# EAGLE design ライン_後 (EAGLE 9.6.2)
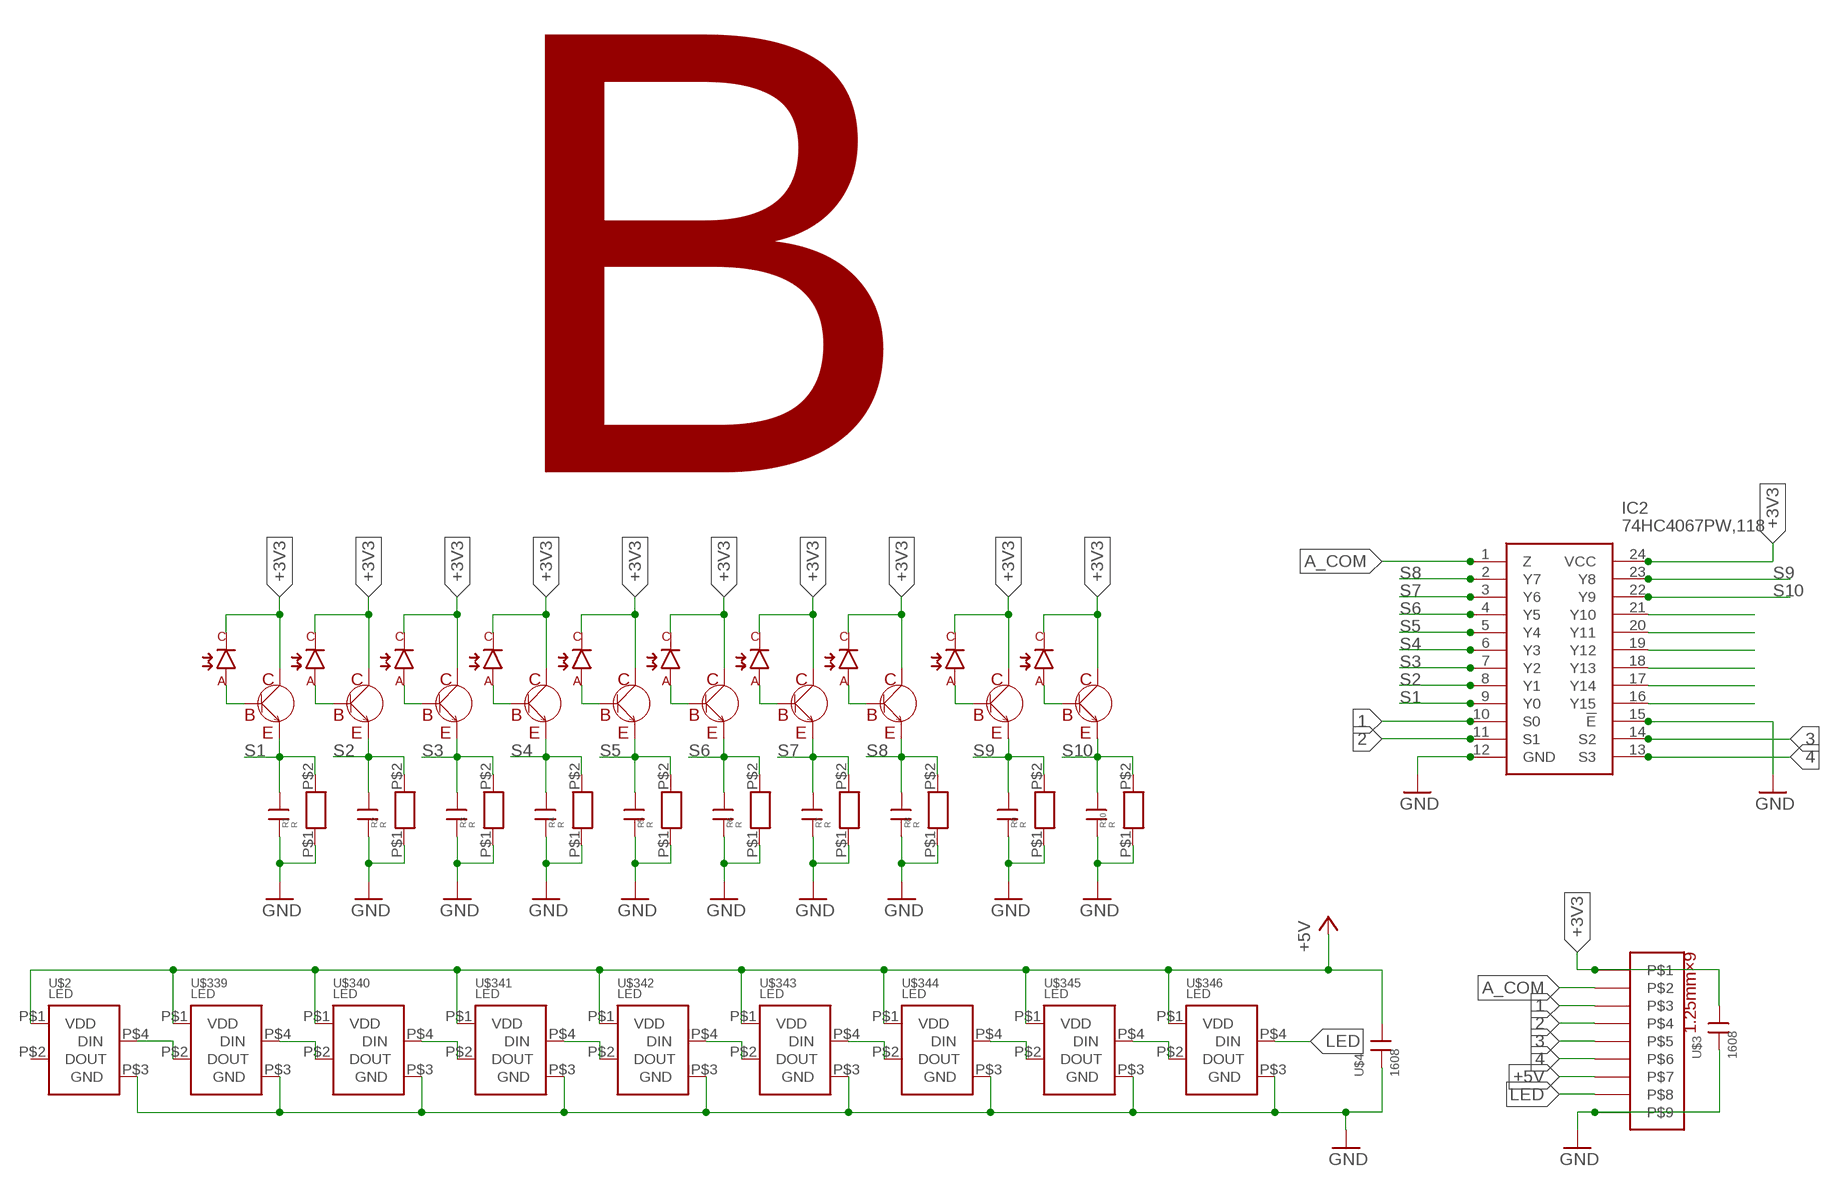
[diagram p0: schematic, sheet 1]

## Parts
C1  1608  [CON]
C2  1608  [CON]
C3  1608  [CON]
C4  1608  [CON]
C5  1608  [CON]
C6  1608  [CON]
C7  1608  [CON]
C8  1608  [CON]
C9  1608  [CON]
C10  1608  [CON]
IC2  74HC4067PW,118  [SOP65P640X110-24N]
R1  R  [1608]
R2  R  [1608]
R3  R  [1608]
R4  R  [1608]
R5  R  [1608]
R6  R  [1608]
R7  R  [1608]
R8  R  [1608]
R9  R  [1608]
R10  R  [1608]
U$1  1MMCON  [1MMCON]
U$2  LED  [LED]
U$3  1608  [CON]
U$4  1608  [CON]
U$33  2CS2712  [TRANS_SSM3J325F,LF]
U$34  フォトダイオード  [フォトダイオード]
U$35  2CS2712  [TRANS_SSM3J325F,LF]
U$36  フォトダイオード  [フォトダイオード]
U$37  2CS2712  [TRANS_SSM3J325F,LF]
U$38  フォトダイオード  [フォトダイオード]
U$39  2CS2712  [TRANS_SSM3J325F,LF]
U$40  フォトダイオード  [フォトダイオード]
U$41  2CS2712  [TRANS_SSM3J325F,LF]
U$42  フォトダイオード  [フォトダイオード]
U$43  2CS2712  [TRANS_SSM3J325F,LF]
U$44  フォトダイオード  [フォトダイオード]
U$45  2CS2712  [TRANS_SSM3J325F,LF]
U$46  フォトダイオード  [フォトダイオード]
U$47  2CS2712  [TRANS_SSM3J325F,LF]
U$48  フォトダイオード  [フォトダイオード]
U$49  2CS2712  [TRANS_SSM3J325F,LF]
U$50  フォトダイオード  [フォトダイオード]
U$51  2CS2712  [TRANS_SSM3J325F,LF]
U$52  フォトダイオード  [フォトダイオード]
U$339  LED  [LED]
U$340  LED  [LED]
U$341  LED  [LED]
U$342  LED  [LED]
U$343  LED  [LED]
U$344  LED  [LED]
U$345  LED  [LED]
U$346  LED  [LED]

## Nets
1: IC2.10(S0) U$1.P$3
2: IC2.11(S1) U$1.P$4
3: IC2.14(S2) U$1.P$5
4: IC2.13(S3) U$1.P$6
+3V3 [New Class]: IC2.24(VCC) U$1.P$1 U$3.P$1 U$33.C U$34.C U$35.C U$36.C U$37.C U$38.C U$39.C U$40.C U$41.C U$42.C U$43.C U$44.C U$45.C U$46.C U$47.C U$48.C U$49.C U$50.C U$51.C U$52.C
+5V [New Class]: U$1.P$7 U$2.P$1(VDD) U$4.P$1 U$339.P$1(VDD) U$340.P$1(VDD) U$341.P$1(VDD) U$342.P$1(VDD) U$343.P$1(VDD) U$344.P$1(VDD) U$345.P$1(VDD) U$346.P$1(VDD)
A_COM: IC2.1(Z) U$1.P$2
GND [New Class]: C1.P$2 C2.P$2 C3.P$2 C4.P$2 C5.P$2 C6.P$2 C7.P$2 C8.P$2 C9.P$2 C10.P$2 IC2.12(GND) IC2.15(!E) R1.P$1 R2.P$1 R3.P$1 R4.P$1 R5.P$1 R6.P$1 R7.P$1 R8.P$1 R9.P$1 R10.P$1 U$1.P$9 U$2.P$3(GND) U$3.P$2 U$4.P$2 U$339.P$3(GND) U$340.P$3(GND) U$341.P$3(GND) U$342.P$3(GND) U$343.P$3(GND) U$344.P$3(GND) U$345.P$3(GND) U$346.P$3(GND)
LED: U$1.P$8 U$346.P$4(DIN)
N$2: U$2.P$4(DIN) U$339.P$2(DOUT)
N$3: IC2.21(Y10)
N$4: IC2.20(Y11)
N$5: IC2.19(Y12)
N$6: IC2.18(Y13)
N$7: IC2.17(Y14)
N$8: IC2.16(Y15)
N$23: U$33.B U$34.A
N$24: U$35.B U$36.A
N$25: U$37.B U$38.A
N$26: U$39.B U$40.A
N$27: U$41.B U$42.A
N$28: U$43.B U$44.A
N$29: U$45.B U$46.A
N$30: U$47.B U$48.A
N$31: U$49.B U$50.A
N$32: U$51.B U$52.A
N$139: U$339.P$4(DIN) U$340.P$2(DOUT)
N$140: U$340.P$4(DIN) U$341.P$2(DOUT)
N$141: U$343.P$4(DIN) U$344.P$2(DOUT)
N$142: U$344.P$4(DIN) U$345.P$2(DOUT)
N$143: U$345.P$4(DIN) U$346.P$2(DOUT)
N$144: U$341.P$4(DIN) U$342.P$2(DOUT)
N$145: U$342.P$4(DIN) U$343.P$2(DOUT)
S1: C1.P$1 IC2.9(Y0) R1.P$2 U$33.E
S2: C2.P$1 IC2.8(Y1) R2.P$2 U$35.E
S3: C3.P$1 IC2.7(Y2) R3.P$2 U$37.E
S4: C4.P$1 IC2.6(Y3) R4.P$2 U$39.E
S5: C5.P$1 IC2.5(Y4) R5.P$2 U$41.E
S6: C6.P$1 IC2.4(Y5) R6.P$2 U$43.E
S7: C7.P$1 IC2.3(Y6) R7.P$2 U$45.E
S8: C8.P$1 IC2.2(Y7) R8.P$2 U$47.E
S9: C9.P$1 IC2.23(Y8) R9.P$2 U$49.E
S10: C10.P$1 IC2.22(Y9) R10.P$2 U$51.E
Unconnected: U$2.P$2(DOUT)

## Notes on the sheet
- B

## Library data of the parts
C1-C10 U$3 U$4 = con1608:1608
IC2 = 16ch MUX:74HC4067PW,118: 74HC(T)4067 - 16-channel analog multiplexer/demultiplexer@en-us Source: Datasheet <https://assets.nexperia.com/documents/data-sheet/74HC_HCT4067.pdf>; DESCRIPTION: 74HC(T)4067 - 16-channel analog multiplexer/demultiplexer@en-us; HEIGHT: 1.1mm; MANUFACTURER_NAME: Nexperia; MANUFACTURER_PART_NUMBER: 74HC4067PW,118; MOUSER_PART_NUMBER: 771-74HC4067PW-T; MOUSER_PRICE-STOCK: https://www.mouser.co.uk/ProductDetail/Nexperia/74HC4067PW118?qs=P62ublwmbi9BArRi%252BuDUjA%3D%3D
R1-R10 = R 1608:R
U$1 = 9P_1.25mmCON:1MMCON
U$2 U$339-U$346 = フルカラーLED:LED
U$33 U$35 U$37 U$39 U$41 U$43 U$45 U$47 U$49 U$51 = 2CS2712:2CS2712
U$34 U$36 U$38 U$40 U$42 U$44 U$46 U$48 U$50 U$52 = フォトダイオード:フォトダイオード

## Net classes
1 New Class: width 0.229 mm
2 NS: width 0.254 mm

## Board
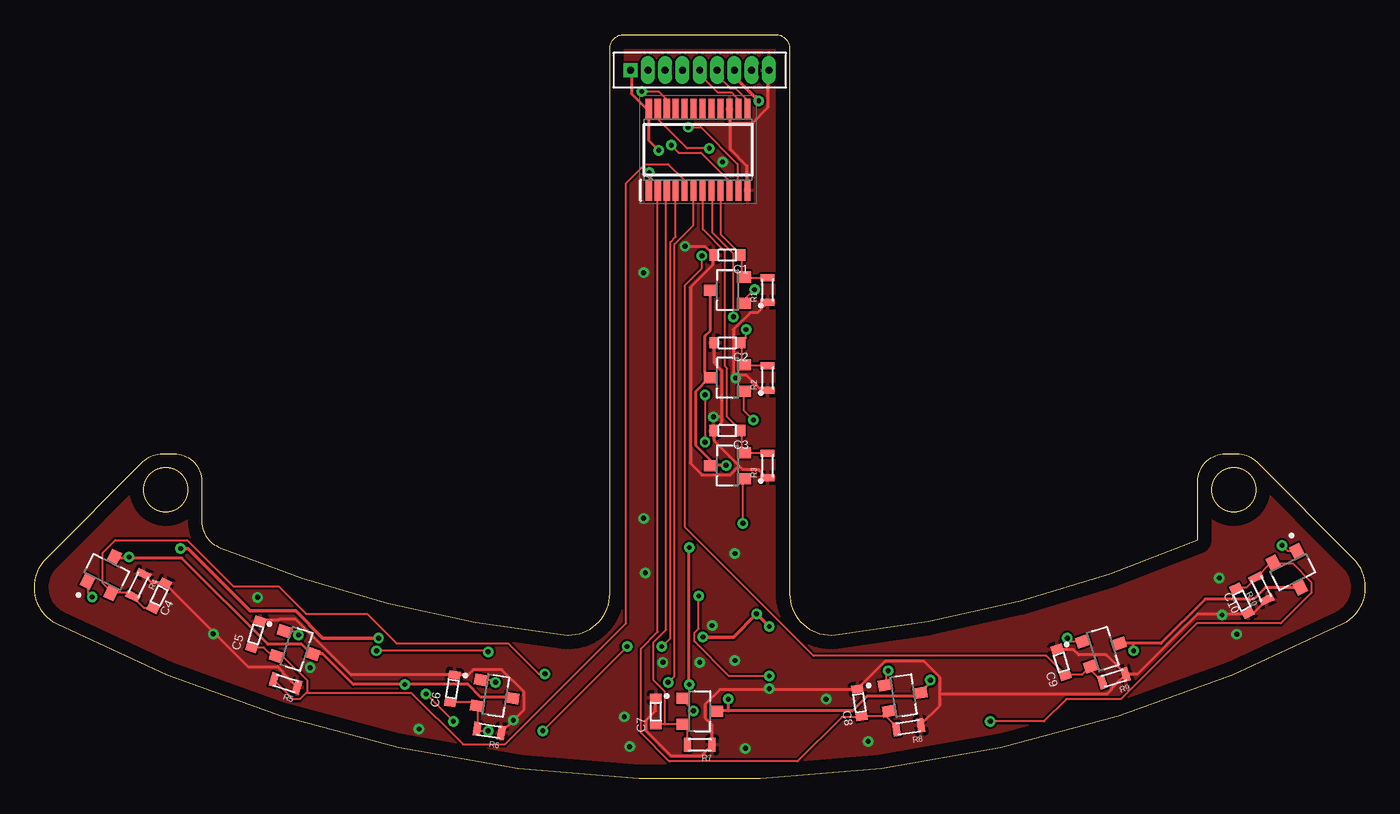
[diagram p1: board, top side]
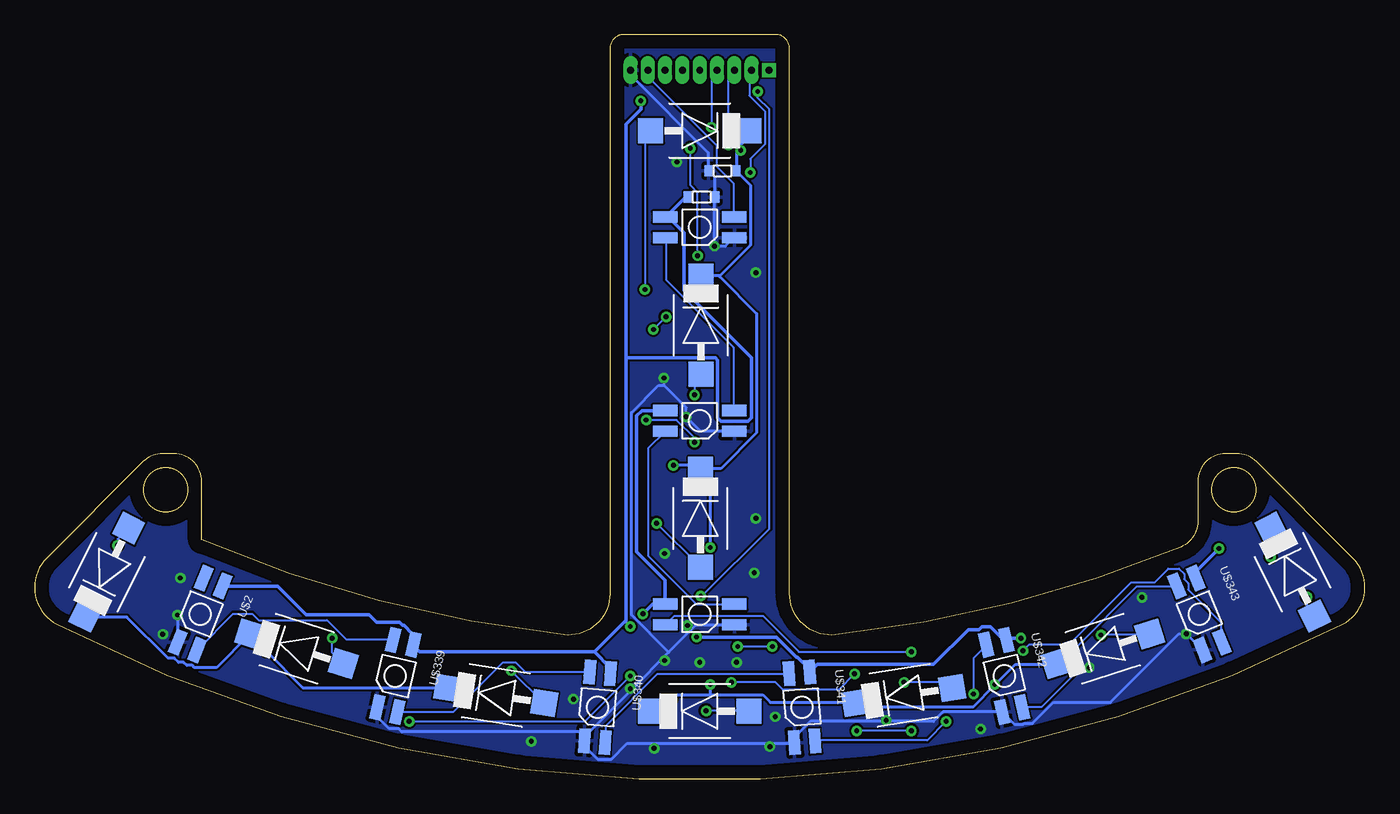
[diagram p2: board, bottom side, seen from below]

Size 96.28 x 53.85 mm. Coordinates in mm from the lower left corner, seen from the top.
Outline: 53.64,53.85 arc-90 54.64,52.85 54.64,13.42 arc96 57.96,10.43 arc17 84.18,17.3 84.18,21.53 arc-90 86.18,23.53 87.02,23.53 arc-45 88.44,22.94 95.4,15.98 arc-108 94.65,11.19 arc-55 1.62,11.19 arc-108 0.88,15.98 7.84,22.94 arc-45 9.26,23.53 10.1,23.53 arc-90 12.1,21.53 12.1,18.63 arc68 13.34,16.78 arc16 38.32,10.43 arc96 41.64,13.42 41.64,52.85 arc-90 42.64,53.85 53.64,53.85
Outline: circle at 9.5,20.93 radius 1.6
Outline: circle at 86.78,20.93 radius 1.6
Copper layers (1*16): Top 0.035mm / dielectric 1.5mm / Bottom 0.035mm
Design rules "default": minimum track width 6mil, minimum drill 0.35mm, track to track 6mil, track to pad 6mil, pad to pad 6mil, via to via 6mil, smd to smd 6mil, copper to edge 40mil, drill to drill 6mil, minimum pad ring 10mil, minimum via ring 8mil, stop-mask expansion 4mil, vias tented up to drill 0mil, thermal gap 10mil

### Footprints (pad centres in the part's own frame; a part is rotated, then mirrored left to right if it is on the bottom)
CON = smd 0.6 x 0.813: P$1 -1,0; P$2 1,0
SOP65P640X110-24N = smd 1.475 x 0.45: 1 -2.938,3.575; 2 -2.938,2.925; 3 -2.938,2.275; 4 -2.938,1.625; 5 -2.938,0.975; 6 -2.938,0.325; 7 -2.938,-0.325; 8 -2.938,-0.975; 9 -2.938,-1.625; 10 -2.938,-2.275; 11 -2.938,-2.925; 12 -2.938,-3.575; 13 2.938,-3.575; 14 2.938,-2.925; 15 2.938,-2.275; 16 2.938,-1.625; 17 2.938,-0.975; 18 2.938,-0.325; 19 2.938,0.325; 20 2.938,0.975; 21 2.938,1.625; 22 2.938,2.275; 23 2.938,2.925; 24 2.938,3.575
1608 = smd 0.508 x 1.016: P$1 -0.889,0; P$2 0.889,0
1MMCON = drill 0.5 square: P$1 0,0 | drill 0.5 long: P$2 1.25,0; P$3 2.5,0; P$4 3.75,0; P$5 5,0; P$6 6.25,0; P$7 7.5,0; P$8 8.75,0; P$9 10,0
LED = smd 1.8 x 0.82: P$1 -2.5,0.75; P$2 -2.5,-0.75; P$3 2.5,-0.75; P$4 2.5,0.75
TRANS_SSM3J325F,LF = smd 1 x 0.8: B -1.2,0.95; C 1.2,0; E -1.2,-0.95
フォトダイオード = smd 1.8 x 1.8: A -3.55,0; C 3.55,0

### Placement (x,y rotation side)
C1  50.14,37.9 180 top
C2  50.14,31.55 180 top
C3  50.14,25.2 180 top
C4  9.02,13.27 63.6 top
C5  16.01,10.47 72.4 top
C6  30.23,6.54 81.2 top
C7  44.96,4.88 90 top
C8  59.7,5.52 98.8 top
C9  74.3,8.44 107.6 top
C10  87.38,12.89 296.4 top
IC2  48.02,45.52 90 top
R1  53.04,35.36 90 top
R2  53.04,29.01 90 top
R3  53.04,22.66 90 top
R4  7.5,14.03 243.6 top
R5  18.17,6.92 162.4 top
R6  32.9,3.49 171.2 top
R7  48.14,2.47 180 top
R8  63.25,3.74 188.8 top
R9  78.11,7.3 197.6 top
R10  88.78,13.77 116.4 top
U$1  43.14,51.28 0 top
U$2  84.29,11.93 248 bottom
U$3  46.49,44 180 bottom
U$4  48.01,42.1 0 bottom
U$33  50.14,35.36 180 top
U$34  48.14,46.9 0 bottom
U$35  50.14,29.01 180 top
U$36  48.06,32.82 90 bottom
U$37  50.14,22.66 180 top
U$38  48.09,18.85 90 bottom
U$39  5.23,14.97 63.6 top
U$40  5.23,14.97 116.4 bottom
U$41  18.96,9.42 342.4 top
U$42  18.96,9.42 197.6 bottom
U$43  33.38,6.04 351.2 top
U$44  33.38,6.04 188.8 bottom
U$45  48.14,4.9 0 top
U$46  48.14,4.9 180 bottom
U$47  62.9,6.04 8.8 top
U$48  62.9,6.04 171.2 bottom
U$49  77.32,9.42 17.6 top
U$50  77.32,9.42 162.4 bottom
U$51  91.05,14.97 296.4 top
U$52  91.05,14.97 243.6 bottom
U$339  70.18,7.45 256.8 bottom
U$340  55.54,5.19 265.6 bottom
U$341  40.74,5.19 274.4 bottom
U$342  26.1,7.45 283.2 bottom
U$343  11.99,11.93 292 bottom
U$344  48.14,11.9 0 bottom
U$345  48.14,25.9 0 bottom
U$346  48.14,39.9 0 bottom

### Tracks (layer width: path | path; a pad name or v marks a point on that pad's centre or on a via)
1  (via drill 0.35)
  Top 0.152: v46.08,45.85 46.62,45.32 48.22,45.32 50.27,43.26 50.27,42.65 IC2.10
  Bottom 0.152: v46.08,45.85 46.08,50.88 45.7,51.26 U$1.P$3
2  (via drill 0.35)
  Top 0.152: v47.3,47.15 48.22,47.15 50.88,44.48 50.88,42.65 IC2.11
  Bottom 0.152: v47.3,47.15 47.3,50.88 46.92,51.26 U$1.P$4
3
  Top 0.152: U$1.P$5 48.14,50.96 49.43,49.66 50.43,49.66 50.88,49.21 50.88,48.52 IC2.14
4
  Top 0.152: IC2.13 51.57,48.52 51.57,49.13 50.73,49.97 50.35,49.97 49.43,50.88 49.43,51.26 U$1.P$6
+3V3  (via drill 0.35)
  Top 0.203: U$43.C 34.5,5.93 32.29,5.93 31.38,6.84 v26.8,6.84 23.07,6.84 20.86,9.05 20.17,9.05 U$41.C 20.02,9.05 19.34,9.74 16.9,9.74 10.65,15.98 6.84,15.98 | 6.84,15.98 5.77,15.98 U$39.C | v6.84,16.06 6.84,15.98 | U$33.C 48.9,35.34 48.9,32.44 48.52,32.06 48.52,29.4 48.83,29.09 U$35.C 48.83,29.01 47.83,28.02 47.83,24.14 48.9,23.07 48.9,22.69 U$37.C 48.98,22.69 v50.04,22.69 | U$1.P$1 43.19,51.26 43.19,49.59 44.25,48.52 44.41,48.52 IC2.24 44.48,48.37 44.48,46.16 v45.17,45.47 | 79.53,9.81 81.52,9.81 84.72,13.01 88.22,13.01 89.06,13.85 91.57,13.85 U$51.C | 79.53,9.81 78.47,9.81 U$49.C | v79.53,9.28 79.53,9.81 | 50.2,4.94 59.19,4.94 60.26,6 63.91,6 64.07,6.15 U$47.C 64.14,6.31 64.83,6.99 v64.83,7.15 | 50.2,4.94 49.36,4.94 U$45.C | v50.2,5.77 50.2,4.94 | v47.38,6.84 v47.38,16.75
  Bottom 0.203: v6.84,16.06 6.84,18.12 U$40.C | 45.36,45.66 44.63,46.39 44.63,46.85 U$34.C | 45.36,45.66 45.47,45.55 45.47,44.03 U$3.P$1 45.47,43.95 44.48,42.96 44.48,38.62 46.69,36.41 | 46.69,36.41 47.99,36.41 U$36.C | U$38.C 48.06,22.46 46.62,22.46 44.02,25.05 44.02,33.66 46.69,36.33 46.69,36.41 | 45.36,45.66 v45.17,45.47 | v50.04,22.69 48.29,22.69 48.14,22.54 U$38.C | U$52.C 92.56,11.72 89.59,11.72 86.62,8.75 86.16,8.75 85.86,8.44 85.48,8.44 85.25,8.21 84.87,8.21 84.72,8.06 83.12,8.06 80.75,10.42 U$50.C 80.68,10.42 v79.53,9.28 76.87,6.61 66.43,6.61 U$48.C 66.35,6.61 65.36,6.61 v64.83,7.15 | 50.2,6.08 50.5,6.08 51.64,4.94 U$46.C | 50.2,6.08 47.38,6.08 | 47.38,6.08 43.57,6.08 43.03,5.54 36.94,5.54 U$44.C 36.79,5.47 36.56,5.24 28.33,5.24 26.77,6.8 | 26.77,6.8 25.28,8.29 22.38,8.29 U$42.C | 50.2,6.08 v50.2,5.77 | v47.38,16.75 47.38,22.39 U$38.C | 47.38,6.08 v47.38,6.84 | v26.8,6.84 26.77,6.8
+5V  (via drill 0.35)
  Top 0.254: v10.57,16.67 11.11,16.67 15.6,12.17 18.88,12.17 20.86,10.19 v24.9,10.19 | v52.41,49.06 50.65,50.81 50.65,51.26 U$1.P$7 | v53.17,11.03 v52.25,11.95 50.58,10.27 v48.37,10.27
  Bottom 0.254: v10.57,16.67 12.17,15.07 12.17,14.54 U$343.P$1 | v24.9,10.19 25.89,10.19 U$342.P$1 25.97,10.12 26.19,10.12 27.11,11.03 27.72,11.03 27.95,10.8 28.71,10.8 31.22,8.29 39.61,8.29 40.14,7.75 U$341.P$1 40.14,7.91 41.05,8.82 41.13,8.82 42.58,10.27 v48.37,10.27 | U$345.P$1 50.65,26.65 52.33,26.65 52.71,26.27 52.71,16.44 50.65,14.38 50.65,12.71 U$344.P$1 50.73,12.63 51.57,12.63 v52.25,11.95 | U$4.P$1 49.05,42.04 49.21,42.04 50.58,40.67 U$346.P$1 50.43,40.67 49.28,39.53 49.28,35.34 44.41,30.46 44.41,26.12 44.63,25.89 46.62,25.89 46.84,26.12 46.84,30.31 47,30.46 53.47,30.46 | 55.76,9.2 54.62,8.06 54.62,7.68 U$340.P$1 | 55.76,9.2 68.41,9.2 68.87,9.66 U$339.P$1 68.94,9.81 68.94,10.5 69.55,11.11 69.63,11.11 69.86,11.34 71.53,11.34 72.07,11.87 76.64,11.87 78.7,13.93 82.58,13.93 U$2.P$1 | v52.41,49.06 52.41,48.45 53.47,47.38 53.47,30.46 | 53.47,30.46 53.47,11.49 53.55,11.41 | 55.76,9.2 53.55,11.41 | 53.55,11.41 v53.17,11.03
A_COM  (via drill 0.35)
  Top 0.152: v44.48,43.87 44.48,42.65 IC2.1
  Bottom 0.152: v44.48,43.87 44.48,44.86 43.42,45.93 43.42,48.29 44.56,49.44 44.56,51.11 44.41,51.26 U$1.P$2
GND  (via drill 0.35)
  Top 0.203: R6.P$1 33.81,3.41 v34.65,4.25 35.41,5.01 35.41,6.31 33.81,7.91 31.76,7.91 31.38,7.53 30.46,7.53 C6.P$2 30.31,7.53 22.92,7.53 18.88,11.56 17.74,11.56 17.66,11.49 16.36,11.49 C5.P$2 | R4.P$1 7.91,14.77 8.44,14.23 9.43,14.23 C4.P$2 9.51,14.08 12.97,10.61 | 12.97,10.61 15.45,8.14 17.58,8.14 17.96,7.75 17.96,7.68 18.95,6.69 R5.P$1 | v12.94,10.5 12.94,10.57 12.97,10.61 | 50.73,29.24 51.49,29.24 52.56,28.18 53.02,28.18 R2.P$1 | 50.73,29.24 50.58,29.4 50.58,32.52 51.8,33.74 52.33,33.74 53.02,34.42 R1.P$1 | 51,22.65 51.26,22.39 52.41,22.39 53.02,21.78 R3.P$1 | 51,22.65 49.21,24.44 49.21,25.2 C3.P$2 49.21,25.28 49.74,25.81 49.74,26.2 | 49.74,26.2 49.74,29.55 49.21,30.08 49.21,31.53 C2.P$2 | 49.74,26.2 v49.13,26.2 | v50.73,29.01 50.73,29.24 | v47.07,38.54 48.52,38.54 49.13,37.93 C1.P$2 49.05,37.85 49.05,37.17 47.45,35.57 47.45,22.84 48.29,22 50.35,22 51,22.65 | 50.35,47.45 50.35,45.55 51.57,44.33 51.57,42.65 IC2.12 | 50.35,47.45 50.35,48.45 IC2.15 | 50.35,47.45 51.95,47.45 53.09,48.6 53.09,51.26 U$1.P$9 | R10.P$1 89.14,12.94 88.22,12.02 87.84,12.02 C10.P$2 87.76,11.95 85.93,11.95 | C9.P$2 74.05,9.35 75.19,9.35 75.57,8.97 77.55,8.97 78.92,7.6 R9.P$1 | 85.93,11.95 84.18,11.95 79.84,7.6 79,7.6 R9.P$1 | v85.93,11.87 85.93,11.95 | C7.P$2 44.94,5.85 44.94,4.94 44.25,4.25 44.25,3.49 46.08,1.66 48.22,1.66 R7.P$1 48.98,2.5 48.98,3.94 48.52,4.4 48.52,5.39 49.59,6.46 53.17,6.46 | 65.51,6.15 65.51,5.32 64.14,3.94 R8.P$1 | 65.51,6.15 65.51,7.37 64.37,8.52 61.55,8.52 59.57,6.54 C8.P$2 59.49,6.46 53.17,6.46 | 65.51,6.15 77.63,6.15 77.93,6.46 77.93,6.54 78.92,7.53 R9.P$1
  Top 0.203: v53.17,6.54 53.17,6.46
  Bottom 0.203: U$343.P$3 11.79,9.35 v12.94,10.5 13.47,10.5 18.42,5.54 22.54,5.54 24.06,4.02 24.67,4.02 24.75,3.94 25.36,3.94 26.19,4.78 U$342.P$3 26.27,4.86 30.54,4.86 31.22,4.17 34.65,4.17 | 34.65,4.17 40.14,4.17 41.28,3.03 41.28,2.65 U$341.P$3 41.36,2.57 53.4,2.57 54.54,1.43 55.53,1.43 56.45,2.34 56.45,2.73 U$340.P$3 | v34.65,4.25 34.65,4.17 | U$345.P$3 45.7,25.2 48.14,25.2 v49.13,26.2 49.13,26.88 50.73,28.48 | 50.73,28.48 v50.73,29.01 | U$346.P$3 45.7,39.15 46.31,38.54 v47.07,38.54 47.07,42.04 U$4.P$2 47.07,42.12 47.07,43.57 47.45,43.95 U$3.P$2 47.53,44.03 47.53,45.32 53.09,50.88 53.09,51.26 U$1.P$9 | 50.39,9.16 48.44,11.11 45.7,11.11 U$344.P$3 | 50.39,9.16 53.05,6.5 | 53.05,6.5 56.45,3.11 56.45,2.8 U$340.P$3 | U$339.P$3 71.46,5.16 71.46,4.48 70.62,3.64 69.93,3.64 69.7,3.41 56.83,3.41 56.52,3.11 U$340.P$3 | v85.93,11.87 85.93,9.96 U$2.P$3 | v53.17,6.54 53.09,6.54 53.05,6.5 | 50.73,28.48 51.11,28.48 53.09,26.5 53.09,11.87 50.39,9.16
  other vias: 43.06,2.34 27.82,3.61 19.95,8.06 16.14,13.14 49.79,44.64 85.73,14.54 87,10.47 60.33,2.73 57.28,5.77 51.44,2.22 42.68,4.5 45.47,8.44 48.14,8.44 50.68,8.57 49.03,11.11 50.68,16.31 44.2,14.92 44.08,18.85 44.08,36.63
  pour Bottom: 49.41,64.57 -1.39,64.57 -1.39,3.61 -1.39,-4.01 98.94,-4.01 98.94,64.57
  pour Top: -5.2,67.11 -5.2,-7.82 102.75,-7.82 102.75,67.11
LED
  Bottom 0.152: U$346.P$4 45.7,40.67 45.7,43.11 46.92,44.33 46.92,45.85 51.87,50.81 51.87,51.26 U$1.P$8
N$2
  Bottom 0.152: U$339.P$2 70.39,10.12 73.74,10.12 75.11,11.49 80.07,11.49 80.52,11.95 81.9,11.95 84.49,9.35 U$2.P$4
N$23  (via drill 0.35)
  Top 0.152: v52.1,35.42 51.34,34.65 U$33.B
  Bottom 0.152: v52.1,35.42 52.1,46.46 51.72,46.85 U$34.A
N$24  (via drill 0.35)
  Top 0.152: v52.03,25.97 51.34,26.65 51.34,28.02 U$35.B | v48.52,27.8 v48.52,24.37
  Bottom 0.152: v52.03,25.97 49.82,25.97 48.52,24.67 v48.52,24.37 | v48.52,27.8 48.52,28.79 48.06,29.24 U$36.A
N$25  (via drill 0.35)
  Top 0.152: v51.26,18.5 51.26,21.7 U$37.B
  Bottom 0.152: v51.26,18.5 48.14,15.37 U$38.A
N$26  (via drill 0.35)
  Top 0.152: v4.17,13.16 3.87,13.47 3.87,14.31 U$39.B
  Bottom 0.152: v4.17,13.16 4.17,12.25 3.71,11.79 U$40.A
N$27  (via drill 0.35)
  Top 0.152: v19.11,10.42 18.88,10.65 18.12,10.65 U$41.B
  Bottom 0.152: v19.11,10.42 15.6,10.42 U$42.A
N$28  (via drill 0.35)
  Top 0.152: v33.36,6.99 33.2,7.15 32.37,7.15 U$43.B
  Bottom 0.152: v33.36,6.99 30.31,6.99 29.93,6.61 U$44.A
N$29  (via drill 0.35)
  Top 0.152: v47.68,4.94 47,5.62 47,5.85 U$45.B
  Bottom 0.152: v47.68,4.94 44.63,4.94 U$46.A
N$30  (via drill 0.35)
  Top 0.152: v61.78,7.83 61.63,7.68 61.63,6.84 U$47.B
  Bottom 0.152: v61.78,7.83 59.42,5.47 U$48.A
N$31  (via drill 0.35)
  Top 0.152: v74.73,10.19 74.96,9.96 75.88,9.96 U$49.B
  Bottom 0.152: v74.73,10.19 74.73,9.13 73.97,8.36 U$50.A
N$32  (via drill 0.35)
  Top 0.152: v90.28,16.9 90.66,16.52 91.34,16.52 U$51.B
  Bottom 0.152: v90.28,16.9 90.28,17.36 89.52,18.12 U$52.A
N$139
  Bottom 0.152: U$340.P$2 56.14,7.75 60.79,7.75 61.47,8.44 62.39,8.44 65.97,4.86 70.01,4.86 U$339.P$4
N$140
  Bottom 0.152: U$341.P$2 41.74,7.6 51.19,7.6 54.92,3.87 54.92,2.65 U$340.P$4
N$141  (via drill 0.35)
  Top 0.152: v24.75,9.28 32.75,9.28 v32.82,9.2
  Bottom 0.152: v24.75,9.28 24.29,9.74 21.39,9.74 16.9,14.23 15.22,14.23 14.23,15.22 13.47,15.22 13.09,14.84 13.09,14.46 12.78,14.16 12.78,13.7 10.42,11.34 10.42,9.96 U$343.P$4 | v32.82,9.2 40.98,9.2 43.57,11.79 49.97,11.79 50.58,11.18 U$344.P$2
N$142
  Bottom 0.152: U$344.P$4 45.7,12.63 48.37,12.63 51.87,16.14 51.87,23.91 50.65,25.13 U$345.P$2
N$143
  Bottom 0.152: U$345.P$4 45.7,26.73 45.7,31.22 50.58,36.1 50.58,39.15 U$346.P$2
N$144  (via drill 0.35)
  Top 0.152: v28.33,6.15 v30.31,4.17
  Bottom 0.152: v30.31,4.17 31.68,2.8 39.76,2.8 U$341.P$4 | v28.33,6.15 28.33,8.75 27.41,9.66 U$342.P$2
N$145
  Bottom 0.152: U$343.P$2 13.7,13.93 16.52,13.93 20.94,9.51 20.94,7.68 23.37,5.24 24.75,5.24 U$342.P$4
S1
  Top 0.152: R1.P$2 51.34,36.25 U$33.E 51.26,36.33 51.19,36.41 51.19,37.85 C1.P$1 51.11,37.93 49.66,39.38 49.66,42.58 IC2.9
S2  (via drill 0.35)
  Top 0.152: R2.P$2 53.02,29.93 51.34,29.93 U$35.E 51.26,30.01 51.19,30.08 51.19,31.53 C2.P$1 51.19,31.61 51.49,31.91 v51.49,32.52 | v50.58,33.43 50.58,38.01 49.05,39.53 49.05,42.58 IC2.8
  Bottom 0.152: v51.49,32.52 v50.58,33.43
S3
  Top 0.152: R3.P$2 53.02,23.6 51.42,23.6 U$37.E 51.26,23.68 51.19,23.76 51.19,25.2 C3.P$1 51.11,25.2 50.12,26.2 50.12,29.7 49.97,29.85 49.97,38.16 48.37,39.76 48.37,42.58 IC2.7
S4  (via drill 0.35)
  Top 0.152: C4.P$1 8.52,12.4 7.91,12.4 7.14,13.16 R4.P$2 7.07,13.24 6.84,13.47 5.62,13.47 U$39.E 5.54,13.55 4.93,14.16 4.93,16.37 5.85,17.28 11.03,17.28 14.38,13.93 17.66,13.93 19.64,11.95 24.06,11.95 26.19,9.81 34.27,9.81 36.48,7.6 v36.94,7.6 | v45.85,6.99 46.31,7.45 46.31,38.69 47.68,40.06 IC2.6
  Bottom 0.152: v45.85,6.99 42.65,6.99 42.12,6.46 38.08,6.46 v36.94,7.6
S5
  Top 0.152: C5.P$1 15.75,9.51 16.59,9.51 17.2,8.9 17.51,8.9 U$41.E 17.58,8.82 18.04,8.82 19.72,7.15 19.72,6.31 19.68,6.27 | 19.68,6.27 19.18,5.77 18.73,5.77 17.35,7.15 R5.P$2 | IC2.5 47,42.65 47,43.34 45.85,44.48 44.18,44.48 42.81,43.11 42.81,11.26 34.04,2.5 30.99,2.5 27.26,6.23 19.72,6.23 19.68,6.27
S6  (via drill 0.35)
  Top 0.152: C6.P$1 31.76,5.54 31.99,5.32 U$43.E 32.06,5.24 32.06,3.64 R6.P$2 32.14,3.64 32.29,3.49 v32.82,3.49 | v45.4,9.58 46.01,10.19 46.01,38.84 46.39,39.23 IC2.4 | v36.79,3.49 v42.88,9.58
  Bottom 0.152: v42.88,9.58 v45.4,9.58 | v32.82,3.49 v36.79,3.49
S7
  Top 0.152: 45.62,3.94 46.92,3.94 U$45.E 46.92,3.87 47.23,3.56 47.23,2.5 R7.P$2 | 45.62,3.94 45.02,3.94 C7.P$1 | 45.62,3.94 45.62,6.31 44.79,7.15 44.79,9.89 45.7,10.8 45.7,42.58 IC2.3
S8
  Top 0.152: R8.P$2 62.31,3.64 62.31,3.87 61.63,4.55 U$47.E 61.86,4.86 61.55,4.55 59.87,4.55 C8.P$1 59.8,4.48 58.43,4.48 55.23,1.28 45.93,1.28 43.87,3.34 43.87,9.43 45.09,10.65 IC2.2
S9  (via drill 0.35)
  Top 0.152: R9.P$2 77.25,7.07 76.33,7.98 U$49.E 76.41,8.14 75.8,7.53 74.66,7.53 C9.P$1 74.58,7.53 73.21,8.9 56.37,8.9 47.07,18.19 47.07,35.72 48.29,36.94 v48.29,37.85 | v48.83,45.63 47.23,45.63 45.17,47.68 45.17,48.45 IC2.23
  Bottom 0.152: v48.83,45.63 48.83,42.96 48.29,42.43 v48.29,37.85
S10  (via drill 0.35)
  Top 0.152: C10.P$1 87,13.85 87.69,13.85 88.37,14.54 R10.P$2 88.45,14.61 89.44,15.6 89.59,15.6 U$51.E 89.67,15.6 91.04,15.6 92.41,14.23 92.41,13.47 90.2,11.26 84.11,11.26 78.62,5.77 74.66,5.77 73.06,4.17 v69.17,4.17 | v43.95,49.74 45.17,49.74 45.7,49.21 45.7,48.52 IC2.22 | v48.06,13.24 48.06,10.88 47.76,10.57 47.76,9.96 50.27,7.45 v53.17,7.45
  Bottom 0.152: v43.95,49.74 43.95,49.28 43.11,48.45 43.11,18.12 47.99,13.24 v48.06,13.24 | v53.17,7.45 56.45,4.17 v69.17,4.17